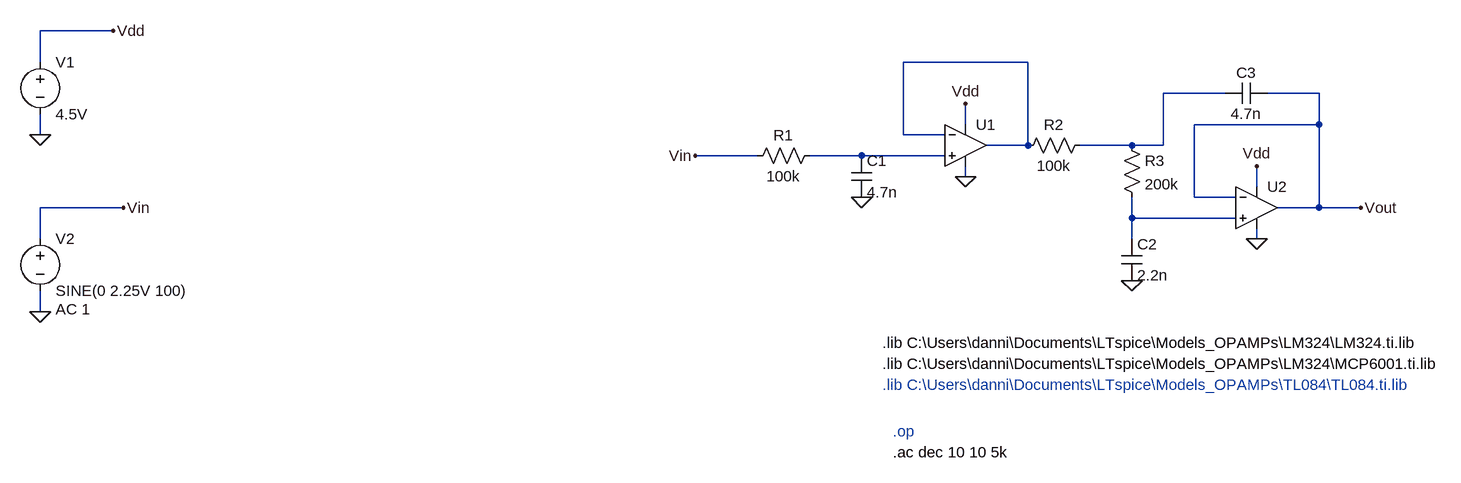
[diagram p0: schematic Analog-Filter.asc]
Analog-Filter.asc, the LTspice schematic file:
Version 4.1
SHEET 1 1480 680
WIRE -976 0 -1088 0
WIRE -1088 48 -1088 0
WIRE 432 48 240 48
WIRE 736 96 640 96
WIRE 880 96 800 96
WIRE 336 144 336 112
WIRE 880 144 880 96
WIRE 880 144 688 144
WIRE -1088 160 -1088 128
WIRE 240 160 240 48
WIRE 304 160 240 160
WIRE 432 176 432 48
WIRE 432 176 368 176
WIRE 592 176 512 176
WIRE 640 176 640 96
WIRE 640 176 592 176
WIRE 16 192 -80 192
WIRE 176 192 96 192
WIRE 304 192 176 192
WIRE 336 224 336 208
WIRE 784 240 784 208
WIRE 688 256 688 144
WIRE 752 256 688 256
WIRE -960 272 -1088 272
WIRE 880 272 880 144
WIRE 880 272 816 272
WIRE 944 272 880 272
WIRE 592 288 592 256
WIRE 752 288 592 288
WIRE -1088 320 -1088 272
WIRE 592 320 592 288
WIRE 784 320 784 304
WIRE -1088 432 -1088 400
FLAG -1088 160 0
FLAG -976 0 Vdd
FLAG 336 224 0
FLAG 336 112 Vdd
FLAG 176 256 0
FLAG 592 384 0
FLAG 784 320 0
FLAG 784 208 Vdd
FLAG 944 272 Vout
FLAG -1088 432 0
FLAG -960 272 Vin
FLAG -80 192 Vin
SYMBOL voltage -1088 32 R0
WINDOW 123 0 0 Left 0
WINDOW 39 0 0 Left 0
SYMATTR InstName V1
SYMATTR Value 4.5V
SYMBOL res 112 176 R90
WINDOW 0 0 56 VBottom 2
WINDOW 3 32 56 VTop 2
SYMATTR InstName R1
SYMATTR Value 100k
SYMBOL cap 160 192 R0
SYMATTR InstName C1
SYMATTR Value 4.7n
SYMBOL res 528 160 R90
WINDOW 0 0 56 VBottom 2
WINDOW 3 32 56 VTop 2
SYMATTR InstName R2
SYMATTR Value 100k
SYMBOL res 576 160 R0
SYMATTR InstName R3
SYMATTR Value 200k
SYMBOL cap 576 320 R0
SYMATTR InstName C2
SYMATTR Value 2.2n
SYMBOL cap 800 80 R90
WINDOW 0 0 32 VBottom 2
WINDOW 3 32 32 VTop 2
SYMATTR InstName C3
SYMATTR Value 4.7n
SYMBOL voltage -1088 304 R0
WINDOW 123 24 124 Left 2
WINDOW 39 0 0 Left 0
SYMATTR Value2 AC 1
SYMATTR InstName V2
SYMATTR Value SINE(0 2.25V 100)
SYMBOL OpAmps\\UniversalOpAmp2 336 176 R0
SYMATTR InstName U1
SYMBOL OpAmps\\UniversalOpAmp2 784 272 R0
SYMATTR InstName U2
TEXT 224 616 Left 2 ;.op
TEXT 208 480 Left 2 !.lib C:\\Users\\danni\\Documents\\LTspice\\Models_OPAMPs\\LM324\\LM324.ti.lib
TEXT 208 512 Left 2 !.lib C:\\Users\\danni\\Documents\\LTspice\\Models_OPAMPs\\LM324\\MCP6001.ti.lib
TEXT 208 544 Left 2 ;.lib C:\\Users\\danni\\Documents\\LTspice\\Models_OPAMPs\\TL084\\TL084.ti.lib
TEXT 224 648 Left 2 !.ac dec 10 10 5k

The netlist it stands for:
* Analog-Filter.asc
V1 Vdd 0 4.5V
R1 N003 Vin 100k
C1 N003 0 4.7n
R2 N002 N001 100k
R3 N002 N004 200k
C2 N004 0 2.2n
C3 Vout N002 4.7n
V2 Vin 0 SINE(0 2.25V 100) AC 1
X§U1 N003 N001 Vdd 0 N001 level2 Avol=1Meg GBW=10Meg Slew=10Meg Ilimit=25m Rail=0 Vos=0 En=0 Enk=0 In=0 Ink=0 Rin=500Meg  ; pins In+ In- V+ V- OUT
X§U2 N004 Vout Vdd 0 Vout level2 Avol=1Meg GBW=10Meg Slew=10Meg Ilimit=25m Rail=0 Vos=0 En=0 Enk=0 In=0 Ink=0 Rin=500Meg  ; pins In+ In- V+ V- OUT
* .op
.lib C:\Users\danni\Documents\LTspice\Models_OPAMPs\LM324\LM324.ti.lib
.lib C:\Users\danni\Documents\LTspice\Models_OPAMPs\LM324\MCP6001.ti.lib
* .lib C:\Users\danni\Documents\LTspice\Models_OPAMPs\TL084\TL084.ti.lib
.ac dec 10 10 5k
.lib UniversalOpAmp2.lib
.backanno
.end